# Altium schematic sheet Sterownik wytrawiarki PCB.SchDoc
size A4; Author: Kajetan Maciejski; CompanyName: KM-Circuits; DrawnBy: Kajetan Maciejski; SheetNumber: 2; SheetTotal: 2
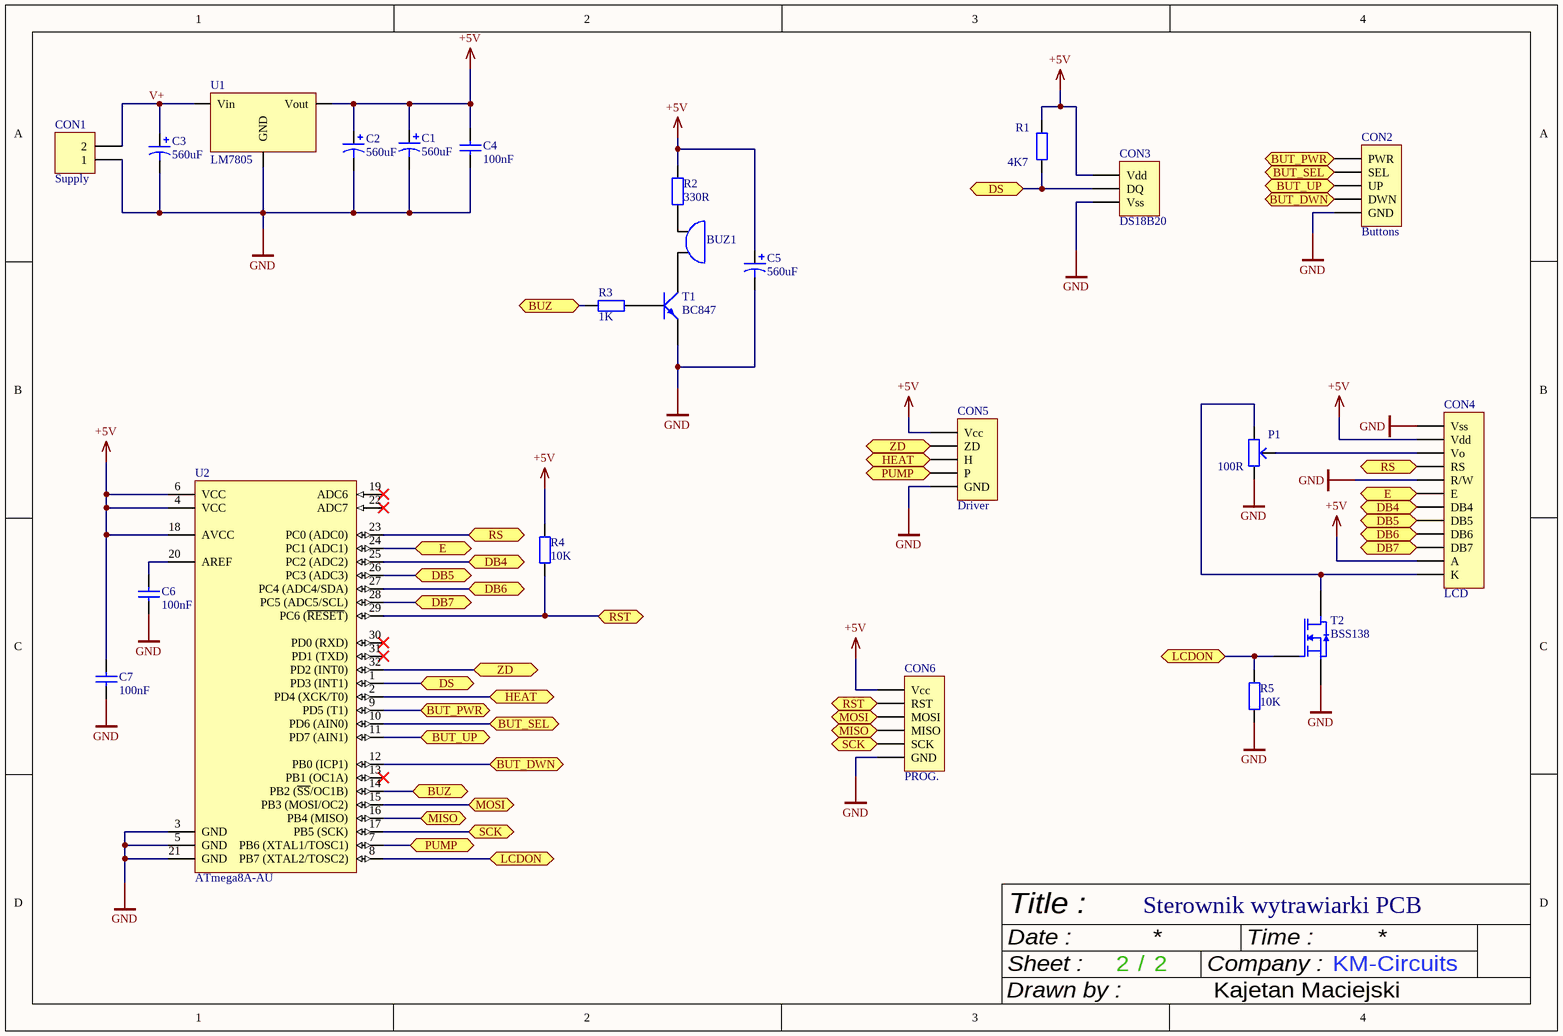
[diagram p0: Sterownik wytrawiarki PCB.SchDoc]

## Parts
BUZ1  Buzzer  [BUZZER 12mm]  (value not drawn)
C1  value 560uF  [CAP 5mm]  (hidden comment: Kondensator spolaryzowany)
C2  value 560uF  [CAP 5mm]  (hidden comment: Kondensator spolaryzowany)
C3  value 560uF  [CAP 5mm]  (hidden comment: Kondensator spolaryzowany)
C4  value 100nF  [CAP 1206]  (hidden comment: Kondensator)
C5  value 560uF  [CAP 5mm]  (hidden comment: Kondensator spolaryzowany)
C6  value 100nF  [CAP 1206]  (hidden comment: Kondensator)
C7  value 100nF  [CAP 1206]  (hidden comment: Kondensator)
CON1  Supply  [HDR1X2]
CON2  Buttons  [HDR1X5]
CON3  DS18B20  [HDR1X3]
CON4  LCD  [HDR1X12]
CON5  Driver  [HDR1X5]
CON6  PROG.  [HDR1X6]
P1  value 100R  [Potencjometr montażowy]  (hidden comment: Potencjometr)
R1  value 4K7  [Axial 8.0-2.3]  (hidden comment: Rezystor)
R2  value 330R  [Axial 8.0-2.3]  (hidden comment: Rezystor)
R3  value 1K  [Axial 8.0-2.3]  (hidden comment: Rezystor)
R4  value 10K  [Axial 8.0-2.3]  (hidden comment: Rezystor)
R5  value 10K  [Axial 8.0-2.3]  (hidden comment: Rezystor)
T1  BC847  [SOT23]
T2  BSS138  [SOT23]
U1  LM7805  [TO-220]
U2  ATmega8A-AU  [32A_N]

## Ports
BUT_DWN, BUT_PWR, BUT_SEL, BUT_UP, BUZ, DB4, DB5, DB6, DB7, DS, E, HEAT, LCDON, MISO, MOSI, PUMP, RS, RST, SCK, ZD

## Nets
+5V: C1.1 C2.1 C4.2 C5.1 C7.2 CON3.1(Vdd) CON4.2(Vdd) CON4.11(A) CON5.5(Vcc) CON6.1(Vcc) R1.2 R2.2 R4.2 U1.Vout U2.4(VCC) U2.6(VCC) U2.18(AVCC)
GND: C1.2 C2.2 C3.2 C4.1 C5.2 C6.1 C7.1 CON1.1 CON2.5(GND) CON3.3(Vss) CON4.1(Vss) CON4.5(R/W) CON5.1(GND) CON6.6(GND) P1.2 R5.1 T1.1(E) T2.1(S) U1.GND U2.3(GND) U2.5(GND) U2.21(GND)
BUT_DWN: CON2.4(DWN) U2.12(PB0_(ICP1)) ; port BUT_DWN
BUT_PWR: CON2.1(PWR) U2.9(PD5_(T1)) ; port BUT_PWR
BUT_SEL: CON2.2(SEL) U2.10(PD6_(AIN0)) ; port BUT_SEL
BUT_UP: CON2.3(UP) U2.11(PD7_(AIN1)) ; port BUT_UP
BUZ: R3.2 U2.14(PB2_(~{SS}/OC1B)) ; port BUZ
DB4: CON4.7(DB4) U2.25(PC2_(ADC2)) ; port DB4
DB5: CON4.8(DB5) U2.26(PC3_(ADC3)) ; port DB5
DB6: CON4.9(DB6) U2.27(PC4_(ADC4/SDA)) ; port DB6
DB7: CON4.10(DB7) U2.28(PC5_(ADC5/SCL)) ; port DB7
DS: CON3.2(DQ) R1.1 U2.1(PD3_(INT1)) ; port DS
E: CON4.6(E) U2.24(PC1_(ADC1)) ; port E
HEAT: CON5.3(H) U2.2(PD4_(XCK/T0)) ; port HEAT
LCDON: R5.2 T2.2(G) U2.8(PB7_(XTAL2/TOSC2)) ; port LCDON
MISO: CON6.4(MISO) U2.16(PB4_(MISO)) ; port MISO
MOSI: CON6.3(MOSI) U2.15(PB3_(MOSI/OC2)) ; port MOSI
PUMP: CON5.2(P) U2.7(PB6_(XTAL1/TOSC1)) ; port PUMP
RS: CON4.4(RS) U2.23(PC0_(ADC0)) ; port RS
RST: CON6.2(RST) R4.1 U2.29(PC6_(~{RESET})) ; port RST
SCK: CON6.5(SCK) U2.17(PB5_(SCK)) ; port SCK
V+: C3.1 CON1.2 U1.Vin
ZD: CON5.4(ZD) U2.32(PD2_(INT0)) ; port ZD
NetBUZ1_V+: BUZ1.V+ R2.1
NetBUZ1_V-: BUZ1.V- T1.3(C)
NetC6_2: C6.2 U2.20(AREF)
NetCON4_3: CON4.3(Vo) P1.3
NetCON4_12: CON4.12(K) P1.1 T2.3(D)
NetR3_1: R3.1 T1.2(B)

Not connected (* = marked no-connect by the designer): U2 13(PB1_(OC1A))* 19(ADC6)* 22(ADC7)* 30(PD0_(RXD))* 31(PD1_(TXD))*

## Notes on the sheet
- Sterownik wytrawiarki PCB
- Title :
- Drawn by :
- Date :
- Sheet :
- /
- Company :
- Time :

## Library data of the parts
C1-C3 C5 = Kondensator spolaryzowany: pin to pad: 1>2 2>1
C4 C6 C7 = Kondensator: Kondensator ceramiczny
CON1 = Header 2: Header, 2-Pin; LatestRevisionDate: 17-Jul-2002; LatestRevisionNote: Re-released for DXP Platform.; Publisher: Altium Limited
CON2 CON5 = Header 5: Header, 5-Pin; LatestRevisionDate: 17-Jul-2002; LatestRevisionNote: Re-released for DXP Platform.; Publisher: Altium Limited
CON3 = Header 3: Header, 3-Pin; LatestRevisionDate: 17-Jul-2002; LatestRevisionNote: Re-released for DXP Platform.; Publisher: Altium Limited
CON4 = Header 12: Header, 12-Pin; LatestRevisionDate: 17-Jul-2002; LatestRevisionNote: Re-released for DXP Platform.; Publisher: Altium Limited
CON6 = Header 6: Header, 6-Pin; LatestRevisionDate: 17-Jul-2002; LatestRevisionNote: Re-released for DXP Platform.; Publisher: Altium Limited
T1 = BC847: NPN (SMD) 100mA; pin to pad: 1>2 2>1
T2 = BSS138: N-MOSFET, 220mA (SMD); pin to pad: 1>2 2>1; Vds: 50
U1 = LM7805: Stabilizator 5V; pin to pad: GND>2 Vin>1 Vout>3
U2 = ATmega8A-AU: 8-bit AVR Microcontroller, 8KB Flash, 512 Bytes EEPROM, 1KB SRAM, 32-pin TQFP, Industrial Grade (-40°C to 85°C); Published: 1-Apr-2010; DatasheetVersion: revC, Jul-2009; PackageVersion: revB, Oct-2001; PackageReference: 32A; Publisher: Altium Limited; PackageDescription: 32-Lead, 7x7x1.0 mm Body, 0.8mm Lead Pitch, Thin Profile Plastic Quad Flat Package (TQFP); Supplier 1: Digi-Key; Supplier Part Number 1: ATMEGA8A-AU-ND; Supplier 2: Farnell; Supplier Part Number 2: 1748532; Supplier 3: Mouser; Supplier Part Number 3: 556-ATMEGA8A-AU; Code_JEDEC: MS-026-ABA; ComponentLink1Description: Manufacturer Link; ComponentLink1URL: http://www.atmel.com/products/avr/default.asp?; ComponentLink2Description: ATmega8A Datasheet; ComponentLink2URL: http://www.atmel.com/dyn/resources/prod_documents/doc8159.pdf; ComponentLink3Description: ATmega8A Summary; ComponentLink3URL: http://www.atmel.com/dyn/resources/prod_documents/8159S.pdf; ComponentLink4Description: Atmel.com Home; ComponentLink4URL: http://www.atmel.com